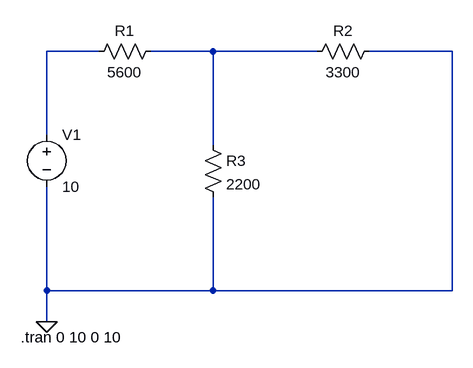
[diagram p0: schematic questão2v1.asc]
questão2v1.asc, the LTspice schematic file:
Version 4
SHEET 1 880 680
WIRE 128 32 48 32
WIRE 304 32 208 32
WIRE 464 32 304 32
WIRE 672 32 544 32
WIRE 48 160 48 32
WIRE 304 176 304 32
WIRE 48 400 48 240
WIRE 304 400 304 256
WIRE 304 400 48 400
WIRE 672 400 672 32
WIRE 672 400 304 400
WIRE 48 448 48 400
FLAG 48 448 0
SYMBOL res 112 48 R270
WINDOW 0 32 56 VTop 2
WINDOW 3 0 56 VBottom 2
SYMATTR InstName R1
SYMATTR Value 5600
SYMBOL res 448 48 R270
WINDOW 0 32 56 VTop 2
WINDOW 3 0 56 VBottom 2
SYMATTR InstName R2
SYMATTR Value 3300
SYMBOL res 288 160 R0
SYMATTR InstName R3
SYMATTR Value 2200
SYMBOL voltage 48 144 R0
WINDOW 123 0 0 Left 0
WINDOW 39 0 0 Left 0
SYMATTR InstName V1
SYMATTR Value 10
TEXT 8 472 Left 2 !.tran 0 10 0 10

The netlist it stands for:
* questão2v1.asc
R1 N001 N002 5600
R2 N002 0 3300
R3 N002 0 2200
V1 N001 0 10
.tran 0 10 0 10
.backanno
.end